# EAGLE board tester (EAGLE 7.5.0)
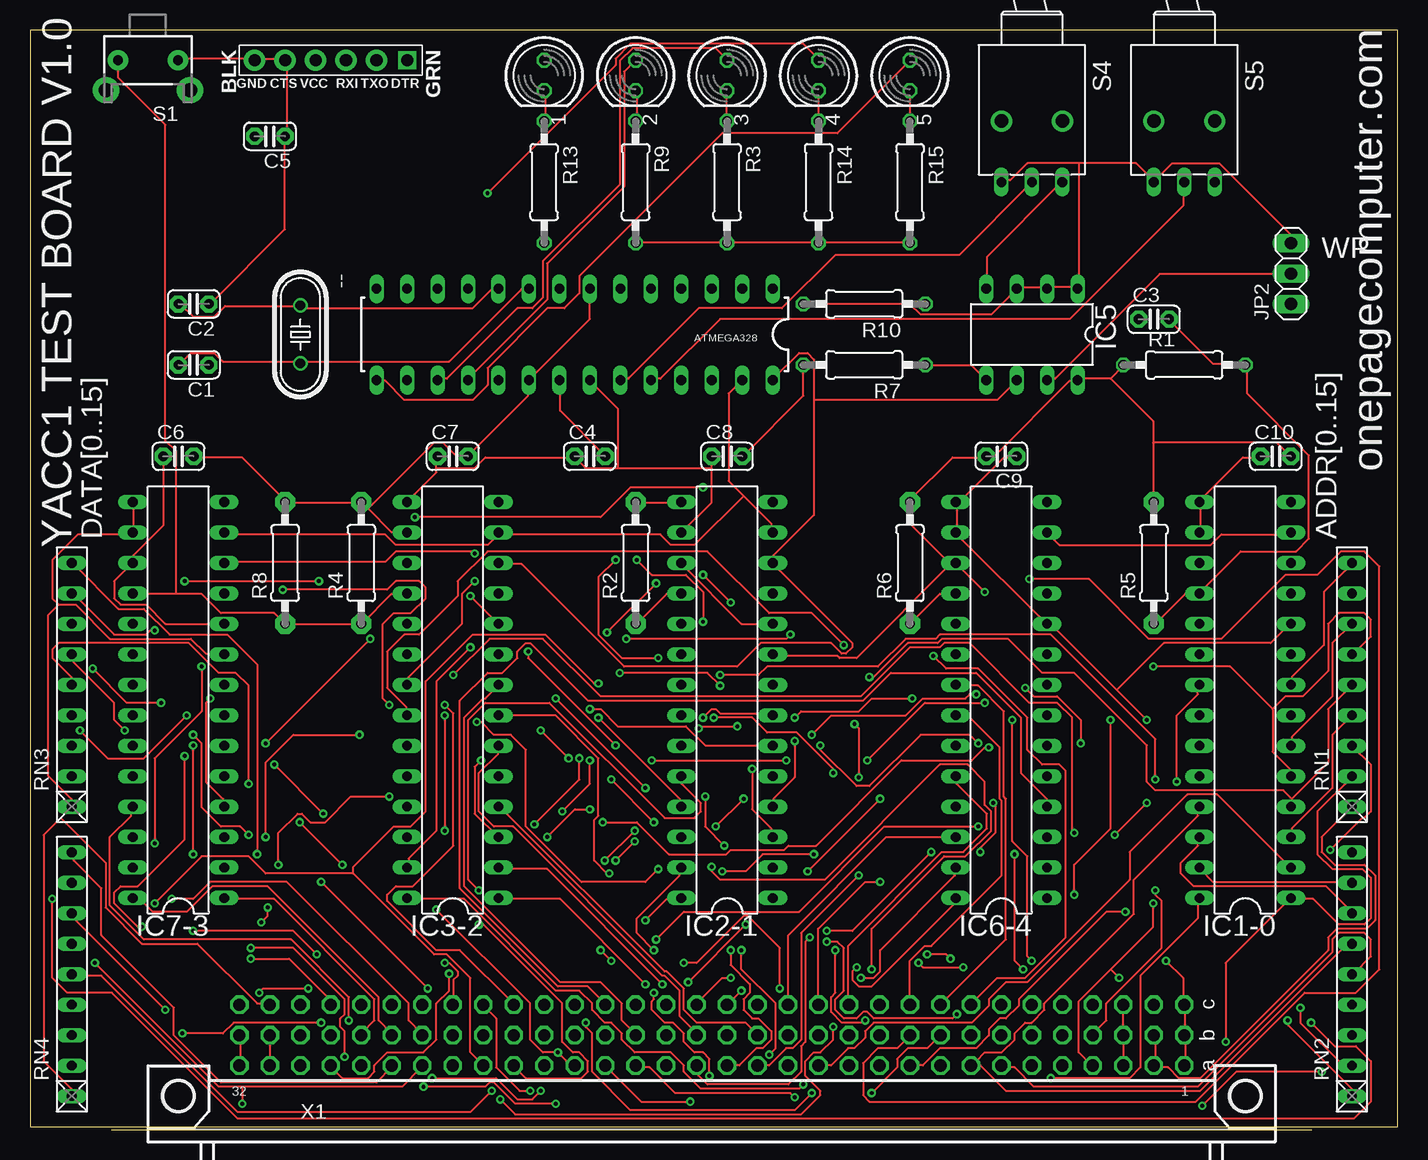
[diagram p3: board, top side]
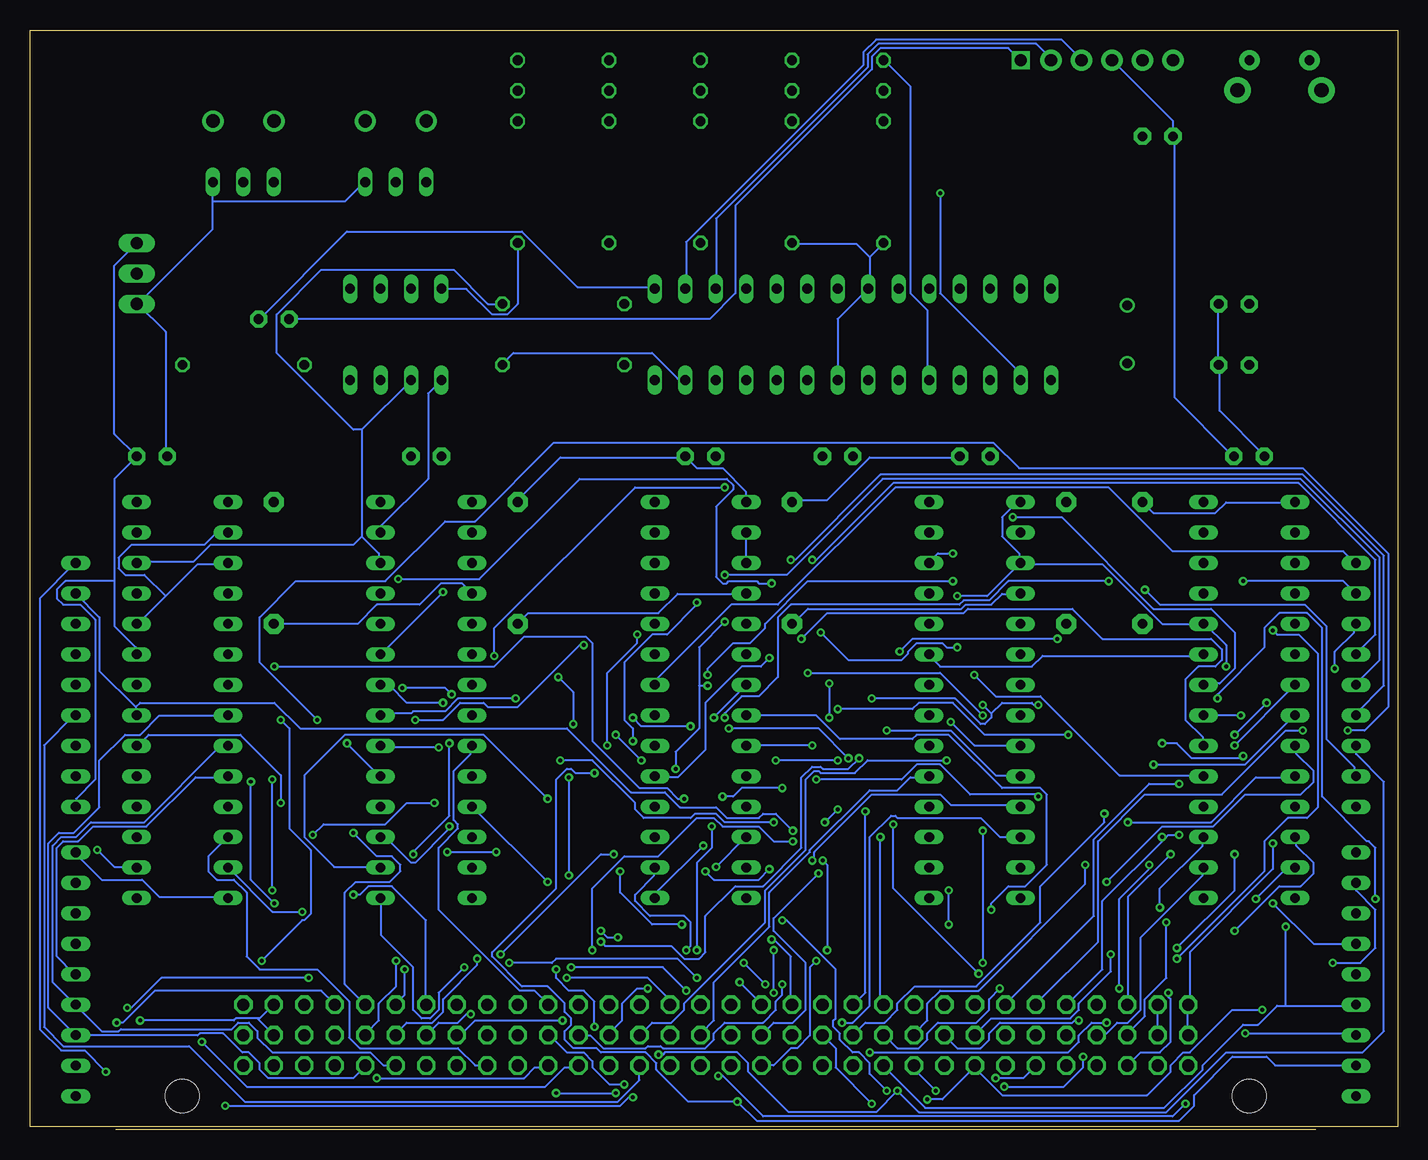
[diagram p4: board, bottom side, seen from below]

Size 113.97 x 91.42 mm. Coordinates in mm from the lower left corner, seen from the top.
Outline: 113.97,0 113.97,91.42 0,91.42 0,0 113.97,0
Copper layers (1*16): Top 0.0356mm / dielectric 1.5011mm / Bottom 0.0356mm
Design rules "LaenPCBOrder *": minimum track width 6mil, minimum drill 13mil, track to track 8mil, track to pad 8mil, pad to pad 8mil, via to via 8mil, smd to smd 6mil, copper to edge 15mil, drill to drill 6mil, minimum pad ring 7mil, minimum via ring 7mil, stop-mask expansion 3mil, vias tented up to drill 0mil, thermal gap 10mil

## Footprints (pad centres in the part's own frame; a part is rotated, then mirrored left to right if it is on the bottom)
LED5MM = drill 0.813 octagon: A -1.27,0; K 1.27,0
HC49/S = drill 0.813: 1 -2.413,0; 2 2.413,0
DIL28-3 = drill 0.813 long: 1 -16.51,-3.81; 2 -13.97,-3.81; 3 -11.43,-3.81; 4 -8.89,-3.81; 5 -6.35,-3.81; 6 -3.81,-3.81; 7 -1.27,-3.81; 8 1.27,-3.81; 9 3.81,-3.81; 10 6.35,-3.81; 11 8.89,-3.81; 12 11.43,-3.81; 13 13.97,-3.81; 14 16.51,-3.81; 15 16.51,3.81; 16 13.97,3.81; 17 11.43,3.81; 18 8.89,3.81; 19 6.35,3.81; 20 3.81,3.81; 21 1.27,3.81; 22 -1.27,3.81; 23 -3.81,3.81; 24 -6.35,3.81; 25 -8.89,3.81; 26 -11.43,3.81; 27 -13.97,3.81; 28 -16.51,3.81
C025-024X044 = drill 0.813 pad 1.422 octagon: 1 -1.27,0; 2 1.27,0
DIL8 = drill 0.813 long: 1 -3.81,-3.81; 2 -1.27,-3.81; 3 1.27,-3.81; 4 3.81,-3.81; 5 3.81,3.81; 6 1.27,3.81; 7 -1.27,3.81; 8 -3.81,3.81
FTDI_DEVICE_SIDE = drill 1 square: P$1 -6.35,0 | drill 1.016 pad 1.778: P$2 -3.81,0; P$3 -1.27,0; P$4 1.27,0; P$5 3.81,0; P$6 6.35,0
1X03 = drill 1.016 long: 1 -2.54,0; 2 0,0; 3 2.54,0
0207/10 = drill 0.813 octagon: 1 -5.08,0; 2 5.08,0
0207/10' = drill 0.813 pad 1.676 octagon: 1 -5.08,0; 2 5.08,0
RN-9 = drill 0.813 long: 1 -10.16,0; 2 -7.62,0; 3 -5.08,0; 4 -2.54,0; 5 0,0; 6 2.54,0; 7 5.08,0; 8 7.62,0; 9 10.16,0
TACTILE-PTH-SIDEEZ = drill 0.8 pad 1.7: 1 -2.5,0; 2 2.5,0 | drill 1.2 pad 2.2: ANCHOR1 -3.5,2.5; ANCHOR2 3.5,2.5
9070-1W = drill 0.813 long: 1 5.08,-2.54; 2 5.08,0; 3 5.08,2.54 | drill 1.118 pad 1.778: B 0,-2.54; B1 0,2.54
FABC96R = drill 1.016 octagon: A1 -2.54,39.37; A2 -2.54,36.83; A3 -2.54,34.29; A4 -2.54,31.75; A5 -2.54,29.21; A6 -2.54,26.67; A7 -2.54,24.13; A8 -2.54,21.59; A9 -2.54,19.05; A10 -2.54,16.51; A11 -2.54,13.97; A12 -2.54,11.43; A13 -2.54,8.89; A14 -2.54,6.35; A15 -2.54,3.81; A16 -2.54,1.27; A17 -2.54,-1.27; A18 -2.54,-3.81; A19 -2.54,-6.35; A20 -2.54,-8.89; A21 -2.54,-11.43; A22 -2.54,-13.97; A23 -2.54,-16.51; A24 -2.54,-19.05; A25 -2.54,-21.59; A26 -2.54,-24.13; A27 -2.54,-26.67; A28 -2.54,-29.21; A29 -2.54,-31.75; A30 -2.54,-34.29; A31 -2.54,-36.83; A32 -2.54,-39.37; B1 -5.08,39.37; B2 -5.08,36.83; B3 -5.08,34.29; B4 -5.08,31.75; B5 -5.08,29.21; B6 -5.08,26.67; B7 -5.08,24.13; B8 -5.08,21.59; B9 -5.08,19.05; B10 -5.08,16.51; B11 -5.08,13.97; B12 -5.08,11.43; B13 -5.08,8.89; B14 -5.08,6.35; B15 -5.08,3.81; B16 -5.08,1.27; B17 -5.08,-1.27; B18 -5.08,-3.81; B19 -5.08,-6.35; B20 -5.08,-8.89; B21 -5.08,-11.43; B22 -5.08,-13.97; B23 -5.08,-16.51; B24 -5.08,-19.05; B25 -5.08,-21.59; B26 -5.08,-24.13; B27 -5.08,-26.67; B28 -5.08,-29.21; B29 -5.08,-31.75; B30 -5.08,-34.29; B31 -5.08,-36.83; B32 -5.08,-39.37; C1 -7.62,39.37; C2 -7.62,36.83; C3 -7.62,34.29; C4 -7.62,31.75; C5 -7.62,29.21; C6 -7.62,26.67; C7 -7.62,24.13; C8 -7.62,21.59; C9 -7.62,19.05; C10 -7.62,16.51; C11 -7.62,13.97; C12 -7.62,11.43; C13 -7.62,8.89; C14 -7.62,6.35; C15 -7.62,3.81; C16 -7.62,1.27; C17 -7.62,-1.27; C18 -7.62,-3.81; C19 -7.62,-6.35; C20 -7.62,-8.89; C21 -7.62,-11.43; C22 -7.62,-13.97; C23 -7.62,-16.51; C24 -7.62,-19.05; C25 -7.62,-21.59; C26 -7.62,-24.13; C27 -7.62,-26.67; C28 -7.62,-29.21; C29 -7.62,-31.75; C30 -7.62,-34.29; C31 -7.62,-36.83; C32 -7.62,-39.37 | hole 2.794: 0,-44.456; 0,44.456

## Placement (x,y rotation side)
1  [LED5MM]  42.85,87.63 270 top
2  [LED5MM]  50.47,87.63 270 top
3  [LED5MM]  58.09,87.63 270 top
4  [LED5MM]  65.71,87.63 270 top
5  [LED5MM]  73.33,87.63 270 top
--  16Mhz  [HC49/S]  22.53,66.04 270 top
ATMEGA328  ATMEGA328P_PDIP  [DIL28-3]  45.39,66.04 180 top
C1  20pf  [C025-024X044]  13.64,63.5 180 top
C2  20pf  [C025-024X044]  13.64,68.58 180 top
C3  0.1  [C025-024X044]  93.65,67.31 0 top
C4  0.1  [C025-024X044]  46.66,55.88 0 top
C5  0.1  [C025-024X044]  19.99,82.55 180 top
C6  0.1  [C025-024X044]  12.37,55.88 0 top
C7  0.1  [C025-024X044]  35.23,55.88 0 top
C8  0.1  [C025-024X044]  58.09,55.88 0 top
C9  0.1  [C025-024X044]  80.95,55.88 180 top
C10  0.1  [C025-024X044]  103.81,55.88 0 top
IC1-0  MCP23017SP  [DIL28-3]  101.27,35.56 90 top
IC2-1  MCP23017SP  [DIL28-3]  58.09,35.56 90 top
IC3-2  MCP23017SP  [DIL28-3]  35.23,35.56 90 top
IC5  24AA01P  [DIL8]  83.49,66.04 180 top
IC6-4  MCP23017SP  [DIL28-3]  80.95,35.56 90 top
IC7-3  MCP23017SP  [DIL28-3]  12.37,35.56 90 top
JP1  FTDI_DEVICE  [FTDI_DEVICE_SIDE]  25.07,88.9 180 top
JP2  [1X03]  105.08,71.12 90 top
R1  10k  [0207/10]  96.19,63.5 0 top
R2  10k  [0207/10']  50.47,46.99 90 top
R3  330  [0207/10]  58.09,78.74 270 top
R4  10k  [0207/10']  27.61,46.99 90 top
R5  10k  [0207/10']  93.65,46.99 90 top
R6  10k  [0207/10']  73.33,46.99 90 top
R7  2.2k  [0207/10]  69.52,63.5 180 top
R8  10k  [0207/10']  21.26,46.99 90 top
R9  330  [0207/10]  50.47,78.74 270 top
R10  2.2k  [0207/10]  69.52,68.58 180 top
R13  330  [0207/10]  42.85,78.74 270 top
R14  330  [0207/10]  65.71,78.74 270 top
R15  330  [0207/10]  73.33,78.74 270 top
RN1  [RN-9]  110.16,36.83 90 top
RN2  [RN-9]  110.16,12.7 90 top
RN3  [RN-9]  3.48,36.83 90 top
RN4  [RN-9]  3.48,12.7 90 top
S1  SWITCH-MOMENTARY-2SIDE_EZ  [TACTILE-PTH-SIDEEZ]  9.83,88.9 180 top
S4  [9070-1W]  83.49,83.82 270 top
S5  [9070-1W]  96.19,83.82 270 top
X1  FABC96R  [FABC96R]  56.82,2.54 270 top

## Tracks (layer width: path | path; a pad name or v marks a point on that pad's centre or on a via)
+12V
  Top 0.152: X1.A3 X1.B3 X1.C3
-RESET
  Top 0.152: IC3-2.18 31.37,44.4 30.12,44.4 27.64,41.91 R4.1 R8.1 21.23,41.91 20.35,42.8 15.9,42.8 14.3,44.4 12.17,44.4 | 12.17,44.4 8.61,44.4 IC7-3.18 | 12.17,44.4 12.17,56.31 11.28,57.2 11.28,83.51 7.37,87.43 7.37,88.85 S1.2 | C3.2 95.02,67.16 98.58,63.6 101.24,63.6 R1.2 101.42,63.42 101.42,61.11 106.58,55.96 106.58,49.02 105.51,47.96 100.89,47.96 97.51,44.58 IC1-0.18 97.33,44.4 96.27,44.4 93.78,41.91 R5.1 | IC2-1.18 54.13,44.4 53.06,44.4 50.57,41.91 R2.1 | R6.1 75.82,44.4 77.06,44.4 IC6-4.18
  Bottom 0.152: ATMEGA328.1 61.95,70 68.35,70 72.97,74.62 87.55,74.62 94.84,67.34 C3.2 | R6.1 72.44,42.8 61.59,42.8 59.99,44.4 54.3,44.4 IC2-1.18 | R5.1 86.66,41.91 85.06,43.51 81.51,43.51 79.73,45.29 77.95,45.29 77.24,44.58 IC6-4.18 | IC3-2.18 31.55,44.4 32.97,44.4 33.86,43.51 35.99,43.51 36.35,43.15 49.15,43.15 50.39,41.91 R2.1
ADDR0  (via drill 0.33)
  Top 0.152: v95.55,28.75 95.55,34.26 97.33,36.04 97.33,36.75 IC1-0.21 | v93.6,18.62 93.6,16.66 90.04,13.11 | 90.04,13.11 87.38,10.44 87.38,6.17 88.44,5.1 X1.A4 | v105.87,9.91 105.87,8.66 109.42,5.1 110.13,5.1 RN2.2 | 90.04,13.11 v90.75,12.39
  Bottom 0.152: v95.55,28.75 95.55,20.57 v93.6,18.62 | v105.87,9.91 105.51,9.91 103.02,12.39 v90.75,12.39
ADDR1
  Bottom 0.152: X1.A5 86.13,4.93 87.02,4.04 94.13,4.04 94.84,4.75 94.84,5.28 95.73,6.17 96.27,6.17 97.87,7.77 99.82,7.77 100,7.59 110.13,7.59 RN2.3 112.45,9.91 112.45,23.6 111.56,24.49 110.31,24.49 108.18,26.62 108.18,30.53 106.04,32.66 104.8,32.66 103.2,34.26 97.51,34.26 IC1-0.22
ADDR2
  Bottom 0.152: IC1-0.23 97.51,31.6 98.22,31.6 104.44,25.38 108.89,25.38 110.13,24.13 111.38,24.13 112.09,23.42 112.09,12.04 110.31,10.26 RN2.4 110.13,10.08 108,7.95 106.58,7.95 106.4,8.13 97.15,8.13 96.62,8.66 95.73,8.66 95.02,7.95 95.02,7.42 93.78,6.17 85.6,6.17 84.53,5.1 83.64,5.1 X1.A6
ADDR3
  Top 0.152: X1.A7 80.97,4.93 82.04,4.93 83.64,3.33 97.33,3.33 108.53,14.53 108.53,15.6 109.07,16.13 111.2,16.13 111.73,15.6 111.73,14.17 110.31,12.75 RN2.5
  Bottom 0.152: IC1-0.24 97.51,29.11 100.18,29.11 104.27,25.02 108.71,25.02 109.96,23.77 111.2,23.77 111.73,23.24 111.73,14.17 110.31,12.75 RN2.5
ADDR4
  Top 0.152: 78.84,5.46 78.49,5.1 X1.A8 78.84,5.46 | 78.84,5.46 79.55,6.17 80.97,6.17 82.04,7.24 82.04,7.77 82.93,8.66 83.46,8.66 84.53,9.73 84.53,10.26 92,17.73 92,20.57 97.33,25.91 97.33,26.62 IC1-0.25 | RN2.6 109.78,15.24 97.51,2.97 81.33,2.97 78.84,5.46
ADDR5
  Top 0.152: IC1-0.26 97.33,24.13 97.33,23.42 95.91,22 95.91,21.11 96.98,20.04 108,20.04 110.13,17.91 RN2.7
  Bottom 0.152: X1.A9 76,5.1 76.89,5.1 78.31,6.53 86.49,6.53 87.38,7.42 87.38,10.44 90.04,13.11 94.84,13.11 95.91,14.17 95.91,19.51 96.98,20.57 98.4,20.57 99.11,21.28 99.11,22.53 97.51,24.13 IC1-0.26
ADDR6  (via drill 0.33)
  Top 0.152: RN2.8 110.13,20.4 98.58,20.4 97.51,21.46 IC1-0.27 | v91.29,17.91 89.69,17.91 82.4,10.62 82.4,10.08 81.33,9.02 80.8,9.02 79.91,8.13 79.91,7.59 78.84,6.53 75.82,6.53 74.4,5.1 73.33,5.1 X1.A10
  Bottom 0.152: v91.29,17.91 93.78,17.91 IC1-0.27
ADDR7  (via drill 0.33)
  Top 0.152: v85.06,4.04 91.64,4.04 92.53,4.93 92.53,12.57 97.33,17.37 97.33,18.97 IC1-0.28
  Bottom 0.152: IC1-0.28 97.51,19.15 103.2,19.15 104.62,20.57 108,20.57 110.13,22.71 RN2.9 | v85.06,4.04 72.8,4.04 71.91,4.93 70.84,4.93 X1.A11
ADDR8  (via drill 0.33)
  Top 0.152: RN1.2 110.13,29.11 107.29,26.26 107.29,22.71 108.53,21.46 111.02,21.46 111.73,20.75 111.73,17.37 111.2,16.84 109.07,16.84 106.93,18.97 105.16,18.97 IC1-0.1 104.98,18.97 99.64,13.64 v99.64,7.06
  Bottom 0.152: v99.64,7.06 95.91,3.33 71.02,3.33 69.42,4.93 68.35,4.93 X1.A12
ADDR9  (via drill 0.33)
  Top 0.152: v108.36,23.06 111.02,25.73 111.2,25.73 111.73,26.26 111.73,30.18 RN1.3 | X1.A13 65.86,5.1 66.75,5.1 68.17,6.53 68.71,6.53 69.6,7.42 69.6,7.95 70.31,8.66 78.49,8.66 79.91,10.08 79.91,10.62 81.33,12.04 83.11,12.04 91.64,20.57 91.64,22.88 96.44,27.69 98.93,27.69 104.98,21.64 IC1-0.2
  Bottom 0.152: v108.36,23.06 106.93,21.64 105.16,21.64 IC1-0.2
ADDR10
  Top 0.152: RN1.4 108.53,32.66 108.53,28.22 105.16,24.84 105.16,24.13 IC1-0.3
  Bottom 0.152: X1.A14 63.2,4.93 63.2,3.86 64.97,2.08 96.09,2.08 100.71,6.71 111.2,6.71 112.8,8.31 112.8,31.77 110.31,34.26 RN1.4
ADDR11  (via drill 0.33)
  Top 0.152: 105.16,27.33 105.16,26.8 IC1-0.4 | 105.16,27.33 108.18,30.35 108.18,34.8 110.13,36.75 RN1.5 | v69.06,20.93 64.26,16.13 64.26,7.24 63.55,6.53 63.02,6.53 61.59,5.1 60.71,5.1 X1.A15 | v69.06,29.11 69.06,33.2 v68.71,33.55 | v69.95,37.46 70.31,37.46 73.15,40.31 75.64,40.31 76,40.66 81.51,40.66 84.35,37.82 87.02,37.82 93.07,31.77 93.07,28.75 93.78,28.04 104.44,28.04 105.16,27.33
  Bottom 0.152: v69.06,29.11 v69.06,20.93 | v68.71,33.55 68.71,36.22 v69.95,37.46
ADDR12  (via drill 0.33)
  Top 0.152: 103.56,34.8 103.56,31.24 104.98,29.82 104.98,29.29 IC1-0.5 | 103.56,34.8 104.62,35.87 106.04,35.87 108.18,38 108.18,41.91 109.07,42.8 111.2,42.8 111.73,42.27 111.73,40.84 110.31,39.42 RN1.6 | v58.4,14.71 58.4,13.46 59.99,11.86 59.99,11.15 59.46,10.62 59.46,9.73 60.17,9.02 60.71,9.02 61.77,7.95 61.77,7.24 61.06,6.53 60.53,6.53 59.11,5.1 58.22,5.1 X1.A16 | v59.46,27.33 v57.15,25.02 | v93.6,38.35 100,38.35 103.56,34.8
  Bottom 0.152: v58.4,14.71 58.4,22 57.15,23.24 v57.15,25.02 | v59.46,27.33 59.99,27.33 60.88,28.22 63.2,28.22 67.11,32.13 67.11,40.31 67.64,40.84 72.8,40.84 75.29,38.35 v93.6,38.35
ADDR13  (via drill 0.33)
  Top 0.152: IC1-0.6 105.16,31.77 105.16,32.49 108.53,35.87 108.53,40.31 110.13,41.91 RN1.7 | X1.A17 55.55,4.39 56.44,3.5 63.2,3.5 64.26,4.57 64.26,6.71 64.62,7.06 64.62,15.42 v64.97,15.77 | v66.4,16.31 68.53,16.31 v75.11,22.88 | v79.2,22.88 79.2,23.24 80.44,24.49 80.44,26.8 v80.26,26.98 | v93.07,26.98 v90.4,24.31
  Bottom 0.152: v64.97,15.77 65.86,15.77 v66.4,16.31 | v79.2,22.88 v75.11,22.88 | v80.26,26.98 82.58,26.98 84.35,25.2 89.51,25.2 v90.4,24.31 | v93.07,26.98 93.07,29.29 96.44,32.66 104.09,32.66 104.98,31.77 IC1-0.6
ADDR14  (via drill 0.33)
  Top 0.152: v47.55,14.71 v48.44,13.82 | v50.39,24.66 v47.91,22.17
  Bottom 0.152: 105.16,34.98 105.16,34.44 IC1-0.7 | 105.16,34.98 108.18,38 108.18,42.44 110.13,44.4 RN1.8 | v48.44,13.82 48.97,13.28 48.97,7.59 50.04,6.53 50.57,6.53 51.99,5.1 52.88,5.1 X1.A18 | v47.55,14.71 47.55,21.82 v47.91,22.17 | v50.39,24.66 51.82,26.09 52.88,26.09 53.24,25.73 55.91,25.73 56.8,26.62 59.82,26.62 61.06,27.86 63.91,27.86 69.24,33.2 91.47,33.2 93.6,35.33 104.8,35.33 105.16,34.98
ADDR15  (via drill 0.33)
  Top 0.152: IC1-0.8 105.16,36.93 105.16,37.46 107.82,40.13 107.82,44.58 110.13,46.89 RN1.9 | v63.73,2.44 63.37,2.79 53.77,2.79 51.64,4.93 50.57,4.93 X1.A19 | v97.69,1.73 100.53,4.57 v107.64,4.57
  Bottom 0.152: v63.73,2.44 64.08,2.44 64.8,1.73 v97.69,1.73 | v107.64,4.57 109.42,6.35 111.38,6.35 113.16,8.13 113.16,44.04 110.31,46.89 RN1.9
ARD-RXIN
  Bottom 0.152: ATMEGA328.2 59.28,70 59.28,73.74 44.53,88.49 44.53,89.56 43.46,90.63 27.99,90.63 26.39,89.03 JP1.P$3
ARD-TXOUT
  Bottom 0.152: ATMEGA328.3 56.8,70 56.8,75.69 44.17,88.32 44.17,89.38 43.28,90.27 30.12,90.27 28.88,89.03 JP1.P$2
CNTL0  (via drill 0.33)
  Top 0.152: v37.06,45.47 35.99,44.4 35.99,41.91 31.55,37.46 31.55,36.93 IC3-2.21 | v57.51,37.64 60.71,37.64 61.42,38.35 70.66,38.35 72.97,40.66 75.46,40.66 75.82,41.02 85.06,41.02 93.78,32.31 v93.78,28.93 | v93.78,19.68 93.78,19.33 94.31,18.8 94.31,14.88 89.69,10.26 89.69,8.84 88.62,7.77 X1.B4
  Bottom 0.152: v37.06,45.47 49.15,45.47 52.7,41.91 52.7,41.55 53.95,40.31 55.37,40.31 57.51,38.18 v57.51,37.64 | v93.78,19.68 v93.78,28.93
CNTL1  (via drill 0.33)
  Top 0.152: v67.82,40.13 65.15,42.8 61.59,42.8 56.44,47.96 38.13,47.96 35.64,45.47 35.64,44.22 32.44,41.02 31.19,41.02 29.77,39.6 29.77,36.58 31.37,34.98 31.37,34.44 IC3-2.22 | v81.86,33.91 81.86,23.77 83.11,22.53 83.11,14.17 v83.46,13.82
  Bottom 0.152: v67.82,40.13 68.17,40.13 73.33,34.98 75.82,34.98 76.17,35.33 78.13,35.33 79.55,33.91 v81.86,33.91 | v83.46,13.82 83.46,11.68 84.89,10.26 84.89,8.84 85.95,7.77 X1.B5
CNTL2  (via drill 0.33)
  Top 0.152: v37.24,33.73 37.59,33.73 38.66,32.66 40.08,32.66 41.33,31.42 41.33,25.02 45.95,20.4 51.28,20.4 v52.35,21.46 | v57.68,21.28 59.64,21.28 61.06,22.71 v65.33,22.71 | v74.75,14.35 76.35,14.35 v76.71,13.99
  Bottom 0.152: v37.24,33.73 35.28,31.77 31.55,31.77 IC3-2.23 | v52.35,21.46 53.24,20.57 56.97,20.57 v57.68,21.28 | v65.33,22.71 66.4,22.71 v74.75,14.35 | v76.71,13.99 76.71,13.46 79.55,10.62 79.55,9.55 80.44,8.66 82.58,8.66 83.46,7.77 X1.B6
CNTL3  (via drill 0.33)
  Top 0.152: v44.88,30.71 v42.57,33.02 | v66.4,15.42 67.28,15.42 67.82,14.88 67.82,11.33 67.11,10.62 67.11,9.73 67.82,9.02 68.88,9.02 69.42,9.55 69.77,9.55 70.31,9.02 76.89,9.02 v77.24,9.37
  Bottom 0.152: v42.57,33.02 37.24,33.02 33.5,29.29 31.55,29.29 IC3-2.24 | v44.88,30.71 45.77,29.82 47.91,29.82 48.08,30 48.79,30 49.68,29.11 49.68,23.24 52.88,20.04 55.19,20.04 57.68,17.55 57.68,14.53 58.22,13.99 59.46,13.99 60.53,15.06 66.04,15.06 v66.4,15.42 | v77.24,9.37 77.6,9.37 78.31,8.66 79.91,8.66 X1.B7
CNTL4  (via drill 0.33)
  Top 0.152: v50.39,23.77 v48.79,22.17 | v67.11,14.71 67.11,11.15 66.75,10.8 66.75,9.55 67.64,8.66 69.42,8.66 v69.6,8.84
  Bottom 0.152: v48.79,22.17 48.62,22.35 48.62,22.88 43.81,27.69 38.13,27.69 37.24,26.8 31.55,26.8 IC3-2.25 | v50.39,23.77 51.99,23.77 53.24,25.02 56.26,25.02 56.97,25.73 58.4,25.73 61.59,22.53 64.44,22.53 67.11,19.86 v67.11,14.71 | v69.6,8.84 76.89,8.84 77.95,7.77 78.31,7.77 X1.B8
CNTL5  (via drill 0.33)
  Top 0.152: v46.3,8.66 46.3,8.31 46.84,7.77 46.84,4.57 50.04,1.37 63.73,1.37 v65.15,2.79 | v70.13,2.79 72.26,4.93 72.26,5.64 73.15,6.53 74.75,6.53 75.82,7.59 X1.B9
  Bottom 0.152: IC3-2.26 33.15,24.13 34.75,25.73 41.68,25.73 41.86,25.91 42.22,25.91 43.99,24.13 43.99,10.08 45.41,8.66 v46.3,8.66 | v70.13,2.79 v65.15,2.79
CNTL6  (via drill 0.33)
  Top 0.152: v36.7,39.95 33.86,37.11 33.86,24.66 31.55,22.35 31.55,21.64 IC3-2.27 | v52.17,45.29 v48.08,41.2 | v83.29,45.64 88.27,45.64 93.24,40.66 99.29,40.66 104.62,46 107.29,46 109.25,47.96 111.2,47.96 112.45,46.71 112.45,13.11 110.49,11.15 106.22,11.15 97.15,2.08 69.95,2.08 69.42,2.62 69.42,5.28 70.66,6.53 72.26,6.53 73.33,7.59 X1.B10
  Bottom 0.152: v36.7,39.95 37.59,39.95 37.95,40.31 40.08,40.31 40.79,39.6 40.79,39.42 41.33,38.89 45.77,38.89 v48.08,41.2 | v52.17,45.29 53.24,45.29 53.42,45.47 55.73,45.47 55.91,45.29 56.26,45.29 56.8,45.82 56.8,51.69 55.37,53.11 55.37,53.47 55.91,54 68.17,54 76.53,45.64 v83.29,45.64
CNTL7  (via drill 0.33)
  Top 0.152: v64.44,3.5 64.08,3.15 55.91,3.15 54.48,4.57 54.48,5.1 53.42,6.17 50.39,6.17 49.33,7.24 49.33,7.77 48.44,8.66 47.91,8.66 46.84,9.73 46.84,10.26 45.77,11.33 43.81,11.33 36.17,18.97 31.55,18.97 IC3-2.28
  Bottom 0.152: v64.44,3.5 65.69,3.5 67.11,4.93 67.11,5.46 67.82,6.17 69.24,6.17 70.66,7.59 X1.B11
CNTL8  (via drill 0.33)
  Top 0.152: v51.28,11.86 44.17,18.97 39.19,18.97 IC3-2.1
  Bottom 0.152: v51.28,11.86 51.28,10.97 51.82,10.44 51.82,9.73 52.88,8.66 56.08,8.66 56.97,7.77 56.97,7.24 57.68,6.53 61.24,6.53 61.42,6.71 62.48,6.71 62.66,6.53 66.22,6.53 67.28,7.59 68.17,7.59 X1.B12
CNTL9  (via drill 0.33)
  Top 0.152: v52.7,11.86 43.1,21.46 39.19,21.46 IC3-2.2 | v54.48,13.64 55.55,13.64 59.46,17.55 59.82,17.55 62.48,14.88 v62.48,11.51
  Bottom 0.152: v54.48,13.64 v52.7,11.86 | v62.48,11.51 63.37,11.51 64.62,10.26 64.62,8.84 65.69,7.77 X1.B13
CNTL10  (via drill 0.33)
  Top 0.152: v37.59,30.53 37.06,30 37.06,26.09 39.02,24.13 IC3-2.3
  Bottom 0.152: v37.59,30.53 44.17,30.53 45.24,29.46 48.08,29.46 48.26,29.64 48.62,29.64 49.33,28.93 49.33,23.06 52.7,19.68 52.7,17.02 59.46,10.26 59.46,9.73 60.53,8.66 62.13,8.66 X1.B14
CNTL11
  Top 0.152: IC3-2.4 39.19,26.62 52.88,12.93 53.06,12.93 54.48,11.51 54.48,9.73 55.55,8.66 59.64,8.66 60.53,7.77 X1.B15
CNTL12
  Bottom 0.152: IC3-2.5 39.19,29.11 40.62,29.11 41.68,28.04 43.99,28.04 48.97,23.06 48.97,22.88 52.35,19.51 52.35,16.66 56.97,12.04 56.97,8.84 58.04,7.77 X1.B16
CNTL13
  Top 0.152: IC3-2.6 39.02,31.6 39.02,31.06 37.41,29.46 37.41,26.26 38.66,25.02 40.26,25.02 52.7,12.57 52.88,12.57 54.13,11.33 54.13,9.2 55.55,7.77 X1.B17
CNTL14  (via drill 0.33)
  Top 0.152: v48.26,21.11 48.08,21.11 47.02,22.17 47.02,25.55 47.37,25.91 47.37,30.71 43.81,34.26 39.19,34.26 IC3-2.7
  Bottom 0.152: v48.26,21.11 51.99,17.37 51.99,16.31 49.33,13.64 49.33,9.73 50.39,8.66 51.99,8.66 52.88,7.77 X1.B18
CNTL15
  Top 0.152: IC3-2.8 39.02,36.75 37.95,35.69 37.77,35.69 36.17,34.09 36.17,20.04 44.17,12.04 47.55,12.04 49.33,10.26 49.33,8.84 50.39,7.77 X1.B19
CNTL16  (via drill 0.33)
  Top 0.152: v13.59,22.71 v13.59,31.77 | v18.39,14.88 21.95,14.88 26.21,10.62 26.21,9.37 25.86,9.02 25.86,8.31 26.21,7.95 v26.21,5.82 | v32.79,3.33 37.95,3.33 38.3,3.68 38.66,3.68 40.44,1.91 v43.81,1.91
  Bottom 0.152: v13.59,31.77 8.61,36.75 IC7-3.21 | v13.59,22.71 13.59,19.68 v18.39,14.88 | v26.21,5.82 26.21,4.93 27.81,3.33 v32.79,3.33 | v43.81,1.91 46.84,4.93 46.84,6.53 X1.B20
CNTL17  (via drill 0.33)
  Top 0.152: v24.44,26.09 v20.35,30.18
  Bottom 0.152: v20.35,30.18 12.7,30.18 8.61,34.26 IC7-3.22 | v24.44,26.09 24.44,25.38 29.77,20.04 29.77,17.02 35.1,11.68 40.26,11.68 41.68,10.26 41.68,9.73 42.75,8.66 44.35,8.66 X1.B21
CNTL18  (via drill 0.33)
  Top 0.152: v33.15,11.51 v24.26,20.4
  Bottom 0.152: v24.26,20.4 19.63,25.02 15.37,25.02 12.7,27.69 8.08,27.69 7.01,28.75 7.01,29.64 8.43,31.06 8.43,31.6 IC7-3.23 | v33.15,11.51 34.04,10.62 34.04,9.73 35.1,8.66 38.3,8.66 39.19,7.77 39.19,7.24 39.9,6.53 41.68,6.53 42.75,7.59 X1.B22
CNTL19  (via drill 0.33)
  Top 0.152: v26.04,21.82 v22.48,25.38
  Bottom 0.152: v22.48,25.38 15.55,25.38 11.81,29.11 8.61,29.11 IC7-3.24 | v26.04,21.82 26.04,20.22 34.93,11.33 38.13,11.33 39.19,10.26 39.19,8.84 40.26,7.77 X1.B23
CNTL20  (via drill 0.33)
  Top 0.152: v26.57,8.84 26.57,10.8 21.77,15.6 9.5,15.6 6.66,18.44 6.66,24.13 8.43,25.91 8.43,26.62 IC7-3.25
  Bottom 0.152: v26.57,8.84 26.92,8.84 27.1,8.66 33.15,8.66 34.04,7.77 34.04,7.24 34.75,6.53 36.7,6.53 37.77,7.59 X1.B24
CNTL21  (via drill 0.33)
  Top 0.152: v13.59,16.31 21.95,16.31 v23.9,14.35
  Bottom 0.152: v13.59,16.31 9.86,20.04 8.08,20.04 7.01,21.11 7.01,22 8.43,23.42 8.43,24.13 IC7-3.26 | v23.9,14.35 23.9,12.93 26.57,10.26 26.57,9.73 27.28,9.02 33.86,9.02 35.1,7.77 X1.B25
CNTL22  (via drill 0.33)
  Top 0.152: v11.81,18.97 13.59,18.97 15.01,20.4 21.41,20.4 31.55,10.26 31.55,8.84 32.61,7.77 X1.B26
  Bottom 0.152: v11.81,18.97 9.32,21.46 8.61,21.46 IC7-3.27
CNTL23
  Top 0.152: IC7-3.28 8.61,18.97 9.14,18.97 10.21,17.91 13.06,17.91 15.19,20.04 19.81,20.04 29.06,10.8 29.06,8.84 30.12,7.77 X1.B27
CNTL24
  Top 0.152: IC7-3.1 16.26,18.97 20.35,18.97 28.7,10.62 28.7,8.84 27.64,7.77 X1.B28
CNTL25
  Bottom 0.152: IC7-3.2 16.26,21.46 16.26,20.93 21.41,15.77 21.41,9.73 22.48,8.66 23.37,8.66 24.26,7.77 24.97,7.77 X1.B29
CNTL26  (via drill 0.33)
  Top 0.152: v19.81,18.26 19.81,17.55 v19.28,17.02
  Bottom 0.152: v19.81,18.26 19.81,19.86 16.26,23.42 16.26,24.13 IC7-3.3 | v19.28,17.02 19.28,12.39 21.06,10.62 21.06,9.2 22.48,7.77 X1.B30
CNTL27  (via drill 0.33)
  Top 0.152: v15.01,35.69 14.66,35.33 14.66,28.75 16.08,27.33 16.08,26.8 IC7-3.4 | v1.85,18.97 1.85,12.39 3.1,11.15 6.83,11.15 17.32,0.66 110.31,0.66 111.73,2.08 111.73,5.46 110.49,6.71 108.71,6.71 v106.76,8.66
  Bottom 0.152: v15.01,35.69 15.01,36.04 11.1,39.95 11.1,41.55 9.86,42.8 7.54,42.8 6.3,41.55 6.3,27.51 2.57,23.77 2.39,23.77 1.85,23.24 v1.85,18.97 | v106.76,8.66 106.22,8.66 103.56,11.33 89.69,11.33 88.62,10.26 X1.C4
CNTL28  (via drill 0.33)
  Top 0.152: v35.28,37.64 38.3,40.66 42.75,40.66 47.55,35.87 69.24,35.87 73.33,39.95 75.82,39.95 76.17,40.31 78.31,40.31 83.29,35.33 85.6,35.33 86.84,34.09 86.84,24.66 v87.02,24.49
  Bottom 0.152: v35.28,37.64 33.5,35.87 29.77,35.87 23.19,29.29 16.26,29.29 IC7-3.5 | v87.02,24.49 85.06,22.53 83.82,22.53 83.11,21.82 83.11,21.28 84,20.4 86.84,20.4 87.73,19.51 87.73,11.86 X1.C5
CNTL29  (via drill 0.33)
  Top 0.152: v49.68,40.66 63.02,40.66 v63.37,41.02 | v65.86,31.77 65.86,31.42 68.88,28.4 69.95,28.4 74.22,32.66 78.31,32.66 v79.02,31.95 | v82.04,22.71 82.04,13.82 v82.75,13.11
  Bottom 0.152: v49.68,40.66 47.55,42.8 36.17,42.8 35.81,43.15 27.1,43.15 24.61,40.66 15.55,40.66 14.66,39.78 14.66,38.89 15.19,38.35 16.61,38.35 17.68,37.29 17.68,33.91 16.26,32.49 16.26,31.77 IC7-3.6 | v63.37,41.02 63.37,40.31 65.86,37.82 v65.86,31.77 | v79.02,31.95 79.02,25.91 82.04,22.88 v82.04,22.71 | v82.75,13.11 82.75,10.97 83.46,10.26 X1.C6
CNTL30  (via drill 0.33)
  Top 0.152: v13.06,34.26 9.5,30.71 6.48,30.71 v4.17,33.02 | v90.04,33.91 90.04,24.84 87.02,21.82 v87.02,19.33
  Bottom 0.152: v13.06,34.26 16.08,34.26 IC7-3.7 | v4.17,33.02 2.74,33.02 0.79,34.98 0.79,47.78 7.9,54.89 31.55,54.89 33.68,57.02 70.31,57.02 76.89,50.44 79.38,50.44 84.35,45.47 91.82,45.47 94.84,42.44 94.84,38.71 v90.04,33.91 | v87.02,19.33 86.49,19.33 85.78,20.04 83.82,20.04 80.97,17.2 80.97,10.26 X1.C7
CNTL31  (via drill 0.33)
  Top 0.152: v32.08,50.8 47.55,50.8 50.04,53.29 v56.08,53.29 | v75.29,39.24 76.35,38.18 79.02,38.18 83.11,34.09 83.11,31.42 84.35,30.18 85.78,30.18 86.31,29.64 86.31,15.77 82.93,12.39 80.62,12.39 78.49,10.26 X1.C8
  Bottom 0.152: v32.08,50.8 27.99,50.8 20.35,43.15 15.55,43.15 13.59,41.2 13.59,38.18 14.83,36.93 16.08,36.93 IC7-3.8 | v56.08,53.29 63.55,53.29 75.29,41.55 v75.29,39.24
CNTL32
  Top 0.152: IC6-4.21 77.24,36.75 79.02,36.75 81.15,34.62 81.15,27.51 81.33,27.33 81.33,15.6 76,10.26 X1.C9
CNTL33
  Top 0.152: X1.C10 73.33,13.82 74.57,15.06 75.11,15.06 80.97,20.93 80.97,27.15 80.8,27.33 80.8,31.6 78.13,34.26 77.24,34.26 IC6-4.22
CNTL34
  Bottom 0.152: IC6-4.23 77.24,31.6 77.24,31.06 78.66,29.64 78.66,25.55 78.31,25.2 78.31,24.84 79.91,23.24 79.91,18.09 73.15,11.33 71.91,11.33 70.84,10.26 X1.C11
CNTL35
  Top 0.152: IC6-4.24 77.24,29.11 77.24,28.57 79.73,26.09 79.73,24.84 77.77,22.88 76,22.88 68.17,15.06 68.17,10.26 X1.C12
CNTL36  (via drill 0.33)
  Top 0.152: v70.84,20.4 69.6,20.4 65.69,16.48 65.69,10.26 X1.C13
  Bottom 0.152: v70.84,20.4 77.06,26.62 IC6-4.25
CNTL37
  Top 0.152: IC6-4.26 71.37,24.13 63.2,15.95 63.2,10.26 X1.C14
CNTL38  (via drill 0.33)
  Top 0.152: v69.24,12.39 70.31,12.39 70.84,12.93 70.84,14.71 77.06,20.93 77.06,21.46 IC6-4.27
  Bottom 0.152: v69.24,12.39 62.48,12.39 60.71,10.62 60.71,10.26 X1.C15
CNTL39  (via drill 0.33)
  Top 0.152: v68.88,13.28 68.53,12.93 68.53,12.22 69.06,11.68 70.13,11.68 77.06,18.62 77.06,18.97 IC6-4.28 | v59.28,11.33 58.22,10.26 X1.C16
  Bottom 0.152: v68.88,13.28 61.24,13.28 v59.28,11.33
CNTL40  (via drill 0.33)
  Top 0.152: v77.77,13.28 74.4,13.28 v74.04,13.64 | v58.4,12.39 57.68,12.39 55.55,10.26 X1.C17
  Bottom 0.152: v77.77,13.28 79.91,11.15 79.91,9.73 80.62,9.02 81.33,9.02 82.04,9.73 82.04,13.28 84.71,15.95 84.71,18.97 IC6-4.1 | v74.04,13.64 70.48,13.64 70.13,13.99 59.99,13.99 v58.4,12.39
CNTL41  (via drill 0.33)
  Top 0.152: v64.8,21.28 v70.84,27.33 | v54.84,12.04 v59.64,16.84
  Bottom 0.152: v70.84,27.33 76.17,32.66 87.73,32.66 91.11,29.29 91.11,24.13 88.62,21.64 84.89,21.64 IC6-4.2 | v64.8,21.28 64.8,19.51 62.13,16.84 v59.64,16.84 | v54.84,12.04 53.06,10.26 X1.C18
CNTL42  (via drill 0.33)
  Top 0.152: v79.02,25.02 71.2,25.02 64.08,17.91 54.48,17.91 v52.17,15.6
  Bottom 0.152: IC6-4.3 84.35,24.13 82.22,22 81.86,22 79.02,24.84 v79.02,25.02 | v52.17,15.6 51.99,15.6 50.57,14.17 50.57,10.26 X1.C19
CNTL43
  Top 0.152: IC6-4.4 84.71,26.8 84.71,27.33 82.58,29.46 82.58,34.09 78.84,37.82 71.73,37.82 69.42,35.51 46.48,35.51 41.68,40.31 41.33,40.31 40.62,39.6 40.62,39.07 39.37,37.82 38.13,37.82 35.81,35.51 35.81,19.86 43.99,11.68 46.48,11.68 47.91,10.26 X1.C20
CNTL44  (via drill 0.33)
  Top 0.152: v87.55,31.95 87.55,33.91 85.6,35.87 83.64,35.87 v82.93,36.58 | v78.84,36.04 78.31,36.04 77.95,35.69 74.4,35.69 72.97,34.26 66.75,34.26 v65.15,32.66 | v51.82,30.53 v63.02,30.53 | v46.66,30.53 46.66,28.57 v44.35,26.26
  Bottom 0.152: v87.55,31.95 84.89,29.29 IC6-4.5 | v82.93,36.58 79.38,36.58 v78.84,36.04 | v63.02,30.53 v65.15,32.66 | v46.66,30.53 v51.82,30.53 | v44.35,26.26 44.35,11.15 45.24,10.26 X1.C21
CNTL45  (via drill 0.33)
  Top 0.152: v79.91,31.6 79.55,31.6 78.49,30.53 72.62,30.53 65.51,23.42 63.2,23.42 62.84,23.06 58.4,23.06 58.04,22.71 53.24,22.71 50.57,25.38 v47.73,25.38 | v46.66,26.44 45.41,26.44 v43.1,24.13
  Bottom 0.152: v79.91,31.6 84.71,31.6 IC6-4.6 | v46.66,26.44 v47.73,25.38 | v43.1,24.13 43.1,10.44 42.93,10.26 X1.C22
CNTL46  (via drill 0.33)
  Top 0.152: v73.51,35.69 70.13,35.69 69.06,34.62 64.26,34.62 v63.73,34.09 | v58.93,33.38 55.91,33.38 v55.73,33.2 | v45.77,30.71 45.77,28.93 v42.04,25.2 | v34.93,12.75 34.93,11.33 33.86,10.26 33.86,7.24 32.79,6.17 29.77,6.17 28.7,5.1 28.7,4.57 28.17,4.04 26.04,4.04 25.15,4.93 X1.A29
  Bottom 0.152: v73.51,35.69 78.31,35.69 79.38,34.62 82.04,34.62 82.22,34.44 84.71,34.44 IC6-4.7 | v63.73,34.09 63.02,33.38 v58.93,33.38 | v55.73,33.2 48.26,33.2 v45.77,30.71 | v42.04,25.2 42.04,19.86 v34.93,12.75
CNTL47  (via drill 0.33)
  Top 0.152: v79.55,35.33 74.57,35.33 v69.77,30.53 | v48.44,28.93 v51.99,25.38 | v29.95,27.51 26.75,27.51 24.61,25.38 23.37,25.38 22.66,26.09 22.3,26.09 20.7,24.49 v20.7,21.82 | v23.19,11.51 19.46,11.51 v19.1,11.15
  Bottom 0.152: v79.55,35.33 82.58,35.33 84,36.75 84.71,36.75 IC6-4.8 | v69.77,30.53 67.11,30.53 63.55,26.98 63.55,26.44 62.84,25.73 58.93,25.73 58.57,26.09 56.8,26.09 56.08,25.38 v51.99,25.38 | v48.44,28.93 41.33,28.93 40.08,30.18 38.13,30.18 35.64,27.69 30.12,27.69 v29.95,27.51 | v20.7,21.82 20.7,21.46 23.19,18.97 v23.19,11.51 | v19.1,11.15 19.1,10.8 18.92,10.62 18.92,7.06 19.81,6.17 21.41,6.17 22.48,5.1 X1.A30
DATA0  (via drill 0.33)
  Top 0.152: v55.02,2.08 50.93,2.08 X1.A20 | v56.97,34.09 60.17,34.09 61.42,32.84 63.91,32.84 66.93,29.82 v66.93,29.46
  Bottom 0.152: RN4.2 3.63,5.1 10.21,5.1 10.92,5.82 13.77,5.82 16.97,2.62 16.97,1.73 18.21,0.48 53.42,0.48 v55.02,2.08 59.11,2.08 61.77,4.75 61.77,5.28 62.66,6.17 66.4,6.17 66.75,6.53 68.71,6.53 69.42,7.24 69.42,7.95 68.88,8.48 68.88,9.02 69.42,9.55 69.42,10.26 70.84,11.68 72.97,11.68 75.46,14.17 75.46,14.53 70.13,19.86 70.13,28.93 69.24,29.82 68.88,29.82 68.53,29.46 v66.93,29.46 | v56.97,34.09 54.3,36.75 IC2-1.21
DATA1  (via drill 0.33)
  Top 0.152: v12.7,7.77 16.08,7.77 16.97,8.66 v24.26,8.66 | X1.A21 45.24,4.93 v43.99,6.17 42.75,6.17 41.68,7.24 41.68,10.26 v33.86,18.09
  Bottom 0.152: v12.7,7.77 3.63,7.77 RN4.3 | v24.26,8.66 25.5,8.66 26.57,7.59 26.57,7.06 27.46,6.17 v43.99,6.17 | v33.86,18.09 33.86,18.62 32.44,20.04 31.01,20.04 29.24,21.82 29.24,27.69 29.77,28.22 32.97,28.22 37.41,32.66 40.08,32.66 40.44,32.31 46.48,32.31 48.44,34.26 54.13,34.26 IC2-1.22
DATA2  (via drill 0.33)
  Top 0.152: v48.79,31.77 41.5,39.07 v41.5,39.6 | v19.63,31.95 v28.35,40.66 | v12.88,30.89 12.88,23.95 8.97,20.04 7.54,20.04 7.01,19.51 7.01,18.62 8.97,16.66 v9.32,16.66
  Bottom 0.152: 9.32,10.08 10.03,10.08 11.63,8.48 12.88,8.48 16.26,5.1 16.26,4.75 19.46,1.55 39.37,1.55 42.75,4.93 X1.A22 | 9.32,10.08 3.63,10.08 RN4.4 | v48.79,31.77 54.13,31.77 IC2-1.23 | v41.5,39.6 40.44,40.66 v28.35,40.66 | v19.63,31.95 18.39,31.95 17.14,30.71 13.06,30.71 v12.88,30.89 | 9.32,10.08 v9.32,16.66
DATA3  (via drill 0.33)
  Top 0.152: v38.48,2.97 36.7,1.19 17.32,1.19 5.94,12.57 3.63,12.57 RN4.5 | v37.41,19.68 36.52,20.57 36.52,33.91 37.95,35.33 43.28,35.33 52.88,25.73 55.37,25.73 55.91,26.26 55.91,26.98 54.3,28.57 54.3,29.11 IC2-1.24 | v37.41,16.84 37.77,16.84 44.35,10.26 44.35,7.06 45.24,6.17 45.77,6.17 46.48,5.46 46.48,4.57 45.95,4.04 41.33,4.04 40.44,4.93 X1.A23
  Bottom 0.152: v38.48,2.97 40.44,4.93 X1.A23 | v37.41,16.84 v37.41,19.68
DATA4  (via drill 0.33)
  Top 0.152: v10.39,18.62 14.3,22.53 18.21,22.53 19.63,21.11 26.92,21.11 | 26.92,21.11 33.68,14.35 34.75,14.35 36.7,12.39 36.7,6.17 37.77,5.1 X1.A24 | v47.37,34.09 54.13,27.33 54.13,26.8 IC2-1.25 | v47.37,36.93 47.02,36.93 42.93,41.02 36.88,41.02 32.97,37.11 32.97,26.26 31.73,25.02 30.3,25.02 26.92,21.64 26.92,21.11
  Bottom 0.152: RN4.6 7.01,15.24 v10.39,18.62 | v47.37,36.93 v47.37,34.09
DATA5  (via drill 0.33)
  Top 0.152: v11.28,9.73 3.63,17.37 3.63,17.73 RN4.7 | v56.8,21.64 56.8,21.28 57.51,20.57 66.22,20.57 75.82,30.18 78.13,30.18 79.55,28.75 79.55,26.8 80.09,26.26 80.09,24.66 77.95,22.53 76.17,22.53 70.13,16.48 v70.13,13.11 | v66.93,8.31 66.93,7.24 65.86,6.17 65.33,6.17 64.62,5.46 64.62,4.22 65.86,2.97 65.86,2.62 64.26,1.02 40.44,1.02 v39.19,2.26
  Bottom 0.152: v11.28,9.73 13.77,9.73 17.32,6.17 17.86,6.17 18.92,5.1 18.92,4.57 20.88,2.62 32.97,2.62 35.28,4.93 | v56.8,21.64 54.3,24.13 IC2-1.26 | v70.13,13.11 70.13,12.39 69.06,11.33 67.82,11.33 66.93,10.44 v66.93,8.31 | v39.19,2.26 37.95,2.26 35.28,4.93 | 35.28,4.93 X1.A25
DATA6  (via drill 0.33)
  Top 0.152: v5.41,13.64 15.72,3.33 17.68,3.33 | 17.68,3.33 31.01,3.33 32.61,4.93 X1.A26 | v51.99,14.71 50.57,16.13 50.57,17.37 54.13,20.93 54.13,21.46 IC2-1.27 | v51.99,11.15 51.99,10.62 51.82,10.44 51.82,9.73 52.88,8.66 53.59,8.66 54.48,7.77 54.48,7.06 55.37,6.17 56.08,6.17 56.62,5.64 v56.62,4.22 | 17.68,3.33 v17.68,1.91
  Bottom 0.152: v5.41,13.64 3.1,13.64 1.85,14.88 1.85,18.09 3.46,19.68 3.46,20.22 RN4.8 | v51.99,11.15 v51.99,14.71 | v56.62,4.22 56.26,4.22 52.88,0.84 18.75,0.84 v17.68,1.91
DATA7  (via drill 0.33)
  Top 0.152: RN4.9 3.63,22.71 3.63,22.17 5.94,19.86 5.94,15.95 11.99,9.91 11.99,7.59 15.9,3.68 28.88,3.68 30.12,4.93 X1.A27 | v51.28,17.2 53.06,18.97 54.13,18.97 IC2-1.28 | v42.57,2.97 41.86,2.26 40.62,2.26 38.84,4.04 v33.5,4.04
  Bottom 0.152: v51.28,17.2 50.93,17.2 46.84,13.11 46.84,9.02 47.02,8.84 47.02,8.31 46.48,7.77 46.48,7.24 45.41,6.17 44.88,6.17 43.99,5.28 43.99,4.39 v42.57,2.97 | v33.5,4.04 31.19,4.04 X1.A27
DATA8  (via drill 0.33)
  Top 0.152: v57.86,23.42 56.26,25.02 v56.26,27.51 | v43.81,35.69 v51.28,28.22 | v34.57,35.15 35.28,34.44 35.28,23.42 31.9,20.04 30.48,20.04 29.77,19.33 29.77,18.8 33.86,14.71 35.81,14.71 40.26,10.26 X1.C23 | v21.06,44.76 29.77,44.76 30.48,45.47 32.44,45.47 32.97,44.93 32.97,44.04 31.73,42.8 30.3,42.8 29.41,41.91 29.41,35.69 v29.95,35.15
  Bottom 0.152: v57.86,23.42 61.77,19.51 61.77,19.15 IC2-1.1 | v56.26,27.51 55.37,27.51 54.66,28.22 v51.28,28.22 | v43.81,35.69 36.88,35.69 34.75,33.55 34.39,33.55 33.86,34.09 33.86,34.44 | v34.57,35.15 33.86,34.44 | v21.06,44.76 19.81,43.51 7.72,43.51 5.94,41.73 5.94,32.31 3.63,30 3.63,29.29 RN3.2 | v29.95,35.15 30.3,35.15 30.48,35.33 32.97,35.33 33.86,34.44
DATA9  (via drill 0.33)
  Top 0.152: v41.68,2.97 40.79,2.97 38.84,4.93 38.84,9.02 37.77,10.08 X1.C24 | v59.28,14.71 59.28,13.11 62.13,10.26 62.13,6.53 v61.59,5.99
  Bottom 0.152: RN3.3 3.46,31.6 3.46,31.06 1.14,28.75 1.14,7.95 2.92,6.17 14.3,6.17 19.28,1.19 39.9,1.19 v41.68,2.97 43.46,1.19 50.75,1.19 54.13,4.57 54.13,5.28 55.02,6.17 61.06,6.17 61.24,5.99 v61.59,5.99 | v59.28,14.71 58.93,15.06 58.93,17.02 59.46,17.55 62.31,17.55 63.55,18.8 63.55,19.33 61.95,20.93 61.95,21.46 IC2-1.2
DATA10  (via drill 0.33)
  Top 0.152: v60.17,29.82 60.17,26.44 61.77,24.84 61.77,24.13 IC2-1.3 | v56.08,42.09 56.08,44.58 54.66,46 51.82,46 v50.57,47.24 | v34.57,13.64 34.93,13.64 35.64,12.93 35.64,12.57 35.28,12.22 35.28,10.26 X1.C25 | v34.57,34.26 v34.57,24.66 | v49.15,37.82 56.44,37.82 v57.51,36.75
  Bottom 0.152: v60.17,29.82 60.17,31.24 58.22,33.2 58.22,36.75 | 58.22,36.75 58.22,39.95 v56.08,42.09 | v50.57,47.24 50.22,47.24 43.1,54.36 7.9,54.36 1.14,47.6 1.14,36.75 3.46,34.44 RN3.4 | v34.57,24.66 v34.57,13.64 | v34.57,34.26 38.13,37.82 v49.15,37.82 | 58.22,36.75 v57.51,36.75
DATA11  (via drill 0.33)
  Top 0.152: v18.21,28.57 18.21,36.75 17.14,37.82 15.72,37.82 13.23,40.31 2.39,40.31 1.85,39.78 1.85,39.07 3.46,37.46 3.46,36.93 RN3.5 | v63.73,32.13 63.73,29.11 61.95,27.33 61.95,26.8 IC2-1.4 | v56.08,46 v58.4,43.69
  Bottom 0.152: v18.21,28.57 20.7,28.57 25.32,23.95 25.32,17.55 32.61,10.26 X1.C26 | v63.73,32.13 63.73,33.2 64.44,33.91 64.44,38.71 62.13,41.02 60.88,41.02 58.4,43.51 v58.4,43.69 | v56.08,46 50.93,46 42.93,54 8.08,54 1.5,47.42 1.5,38.89 3.46,36.93 RN3.5
DATA12  (via drill 0.33)
  Top 0.152: v7.9,33.02 7.01,33.91 7.01,35.33 3.63,38.71 3.63,39.24 RN3.6 | v52.35,39.07 49.33,39.07 47.37,41.02 47.37,45.82 v48.79,47.24
  Bottom 0.152: v7.9,33.02 9.32,33.02 14.66,27.69 21.06,27.69 24.97,23.77 24.97,15.42 30.12,10.26 X1.C27 | v52.35,39.07 53.06,38.35 54.66,38.35 57.68,35.33 57.68,31.42 59.99,29.11 61.77,29.11 IC2-1.5 | v48.79,47.24 48.44,47.24 42.04,53.65 8.25,53.65 1.85,47.24 1.85,41.02 3.46,39.42 RN3.6
DATA13  (via drill 0.33)
  Top 0.152: v5.23,38.18 8.08,35.33 v10.92,35.33 | v13.59,32.66 14.3,31.95 14.3,26.62 15.9,25.02 17.5,25.02 v18.21,24.31 | v46.66,34.8 47.55,34.8 48.97,33.38 54.66,33.38 56.26,31.77 61.77,31.77 IC2-1.6 | v27.46,32.66 21.95,32.66 19.63,30.35 v19.63,24.13
  Bottom 0.152: v5.23,38.18 5.23,39.6 3.63,41.2 3.63,41.91 RN3.7 | v13.59,32.66 v10.92,35.33 | v18.21,24.31 19.1,24.31 19.46,23.95 | 19.46,23.95 24.61,18.8 24.61,13.11 27.46,10.26 X1.C28 | v46.66,34.8 40.44,34.8 39.9,35.33 37.06,35.33 34.39,32.66 v27.46,32.66 | 19.46,23.95 v19.63,24.13
DATA14  (via drill 0.33)
  Top 0.152: v56.08,34.09 56.8,34.8 57.15,34.8 57.51,34.44 61.77,34.44 IC2-1.7 | v12.88,45.47 v24.08,45.47 | v18.39,13.99 21.59,13.99 24.97,10.62 24.97,10.26 X1.C29 | v10.39,41.38 10.03,41.38 9.68,41.02 7.01,41.02 3.63,44.4 RN3.8
  Bottom 0.152: v56.08,34.09 56.08,34.44 54.66,35.87 53.24,35.87 51.64,37.46 51.64,42.44 50.57,43.51 36.52,43.51 36.17,43.87 34.04,43.87 32.44,45.47 v24.08,45.47 | v12.88,45.47 4.52,45.47 3.63,44.58 RN3.8 | v18.39,13.99 11.1,21.28 11.1,23.77 9.14,25.73 7.54,25.73 6.66,26.62 6.66,39.42 8.25,41.02 10.03,41.02 v10.39,41.38
DATA15  (via drill 0.33)
  Top 0.152: v18.92,22.71 18.92,38.53 16.43,41.02 11.63,41.02 9.5,43.15 7.37,43.15 3.63,46.89 RN3.9
  Bottom 0.152: IC2-1.8 61.77,36.93 61.77,37.29 55.55,43.51 51.64,43.51 41.86,53.29 24.08,53.29 18.75,47.96 4.52,47.96 3.63,47.07 RN3.9 | v18.92,22.71 22.48,19.15 22.48,10.26 X1.C30
GND  (via drill 0.33)
  Top 0.152: S1.1 12.34,89.03 18.57,89.03 JP1.P$6 18.75,89.03 21.23,89.03 JP1.P$5 21.41,88.85 21.41,82.63 C5.1 21.23,82.45 21.23,74.8 15.01,68.58 C2.1 | X1.A32 17.5,5.1 17.5,7.59 X1.B32 | C6.1 11.1,50.09 8.61,47.6 8.61,47.07 IC7-3.17 8.43,46.89 7.01,45.47 7.01,44.04 7.54,43.51 9.68,43.51 11.28,41.91 IC7-3.10 | v10.39,23.6 10.39,30.71 14.3,34.62 v14.3,38.35 | X1.A1 96.27,5.1 96.27,7.59 X1.B1 96.27,7.77 96.27,10.08 X1.C1 96.09,10.26 96.09,12.39 v94.67,13.82 | 77.24,51.87 77.24,52.04 IC6-4.15 77.24,51.87 | 77.24,51.87 77.24,49.55 IC6-4.16 77.24,49.38 84.71,41.91 IC6-4.10 85.06,41.91 90.58,36.4 | 77.24,51.87 81.15,55.78 82.22,55.78 C9.1 | 90.58,36.4 v93.07,33.91 | IC1-0.16 97.51,49.55 97.51,52.04 IC1-0.15 97.51,52.22 101.07,55.78 102.49,55.78 C10.1 | IC2-1.10 59.28,41.91 54.3,46.89 IC2-1.17 | 56.8,54.89 56.8,52.04 IC2-1.16 | 56.8,54.89 56.8,55.78 C8.1 | v36.7,44.22 39.02,41.91 IC3-2.10 | 33.86,54.89 33.86,54.53 31.55,52.22 IC3-2.15 | 33.86,54.89 33.86,55.78 C7.1 | 33.86,54.89 37.06,54.89 37.95,55.78 45.24,55.78 C4.1 45.41,55.78 46.3,54.89 48.97,54.89 | 48.97,54.89 56.8,54.89 | IC5.4 79.73,70 79.73,72.49 85.95,78.72 S4.3 | R9.2 50.57,73.74 58.04,73.74 R3.2 58.22,73.74 65.69,73.74 R14.2 65.86,73.74 73.33,73.74 R15.2 | 48.97,54.89 48.97,59.87 46.66,62.18 ATMEGA328.22 | 90.58,36.4 94.49,40.31 103.38,40.31 104.98,41.91 IC1-0.10
  Bottom 0.152: X1.B32 17.5,7.77 17.5,10.08 X1.C32 17.32,10.26 17.32,14.53 10.39,21.46 v10.39,23.6 | C2.1 15.01,68.58 15.01,63.6 C1.1 14.83,63.42 14.83,59.69 11.1,55.96 C6.1 | v14.3,38.35 14.3,40.13 16.08,41.91 IC7-3.10 19.63,41.91 24.61,46.89 31.37,46.89 IC3-2.17 | v94.67,13.82 91.29,17.2 91.11,17.2 90.58,17.73 90.58,23.06 92.35,24.84 92.35,33.2 v93.07,33.91 | 102.67,44.22 104.98,41.91 IC1-0.10 | 102.67,44.22 100,46.89 97.51,46.89 IC1-0.17 | 98.75,77.11 98.75,74.8 104.98,68.58 | 98.75,77.11 98.75,78.72 S5.3 | 104.98,68.58 102.67,66.27 102.67,55.96 C10.1 | 104.98,68.58 JP2.1 | 102.67,44.22 104.44,46 106.04,46 106.58,46.53 106.58,47.42 105.51,48.49 99.47,48.49 98.58,49.38 97.51,49.38 IC1-0.16 | IC2-1.17 54.3,47.07 54.3,49.38 IC2-1.16 | IC3-2.17 31.55,47.07 31.55,47.78 32.97,49.2 32.97,50.8 31.55,52.22 IC3-2.15 | v36.7,44.22 34.21,44.22 31.55,46.89 IC3-2.17 | 43.99,72.49 43.99,70 ATMEGA328.8 44.17,69.82 46.66,67.34 ATMEGA328.22 | 43.99,72.49 42.93,73.56 R13.2 | 43.99,72.49 45.06,73.56 50.39,73.56 R9.2 | R15.2 73.33,68.58 74.22,67.69 75.46,67.69 77.6,69.82 79.55,69.82 IC5.4 | 98.75,77.11 87.73,77.11 86.13,78.72 S4.3
N$1
  Bottom 0.152: ATMEGA328.19 39.19,62.36 39.19,68.05 40.62,69.47 40.62,86.72 42.75,88.85 1.A
N$2
  Top 0.152: IC5.7 84.89,62.36 85.42,62.36 94.13,71.07 104.98,71.07 JP2.2
N$3
  Top 0.152: C1.2 12.52,63.6 13.41,64.49 15.37,64.49 16.08,63.78 22.48,63.78 --.2 22.66,63.78 34.93,63.78 40.97,69.82 41.5,69.82 ATMEGA328.9
N$4
  Top 0.152: C2.2 12.52,68.58 13.59,67.51 15.37,67.51 16.26,68.4 22.48,68.4 --.1 22.66,68.4 22.84,68.22 36.88,68.22 38.48,69.82 39.02,69.82 ATMEGA328.10
N$6
  Top 0.152: ATMEGA328.18 36.52,62.36 43.1,68.94 43.1,71.96 49.51,78.36 49.51,87.96 50.39,88.85 2.A
N$7
  Top 0.152: ATMEGA328.17 34.04,62.36 34.75,62.36 40.62,68.22 41.86,68.22 42.75,69.11 42.75,72.14 49.15,78.54 49.15,88.85 50.22,89.92 57.15,89.92 58.04,89.03 3.A
N$8  (via drill 0.33)
  Top 0.152: v38.13,77.83 48.79,88.49 48.79,89.03 50.04,90.27 64.44,90.27 65.69,89.03 4.A
  Bottom 0.152: v38.13,77.83 38.13,69.47 31.55,62.89 31.55,62.36 ATMEGA328.16
N$9
  Bottom 0.152: JP1.P$1 32.44,89.92 43.1,89.92 43.81,89.21 43.81,88.14 55.19,76.76 55.19,69.47 57.33,67.34 92.35,67.34 C3.1
N$10
  Top 0.152: ATMEGA328.15 28.88,62.18 29.59,62.18 31.19,60.58 36.88,60.58 38.13,61.82 38.13,63.25 43.1,68.22 44.53,68.22 45.77,69.47 45.77,70.89 57.68,82.8 67.28,82.8 73.33,88.85 5.A
N$11
  Top 0.152: R9.1 50.57,83.87 50.57,86.36 2.K
N$12
  Top 0.152: R13.1 42.93,83.87 42.93,86.36 1.K
N$13
  Top 0.152: R3.1 58.04,83.87 58.04,86.36 3.K
N$14
  Top 0.152: ATMEGA328.21 44.17,62.18 44.17,59.69 47.91,55.96 C4.2
N$15
  Top 0.152: R14.1 65.69,83.87 65.69,86.36 4.K
N$16
  Top 0.152: 5.K R15.1
N$18
  Top 0.152: S4.2 77.42,72.67 67.11,72.67 62.66,68.22 55.73,68.22 49.86,62.36 49.33,62.36 ATMEGA328.23
N$19
  Top 0.152: ATMEGA328.24 51.82,62.36 52.53,62.36 57.51,67.34 86.66,67.34 96.09,76.76 96.09,78.72 S5.2
SCL  (via drill 0.33)
  Top 0.152: v37.06,47.78 36.88,47.96 30.48,47.96 29.59,47.07 16.26,47.07 IC7-3.12 | 65.33,60.58 65.33,63.96 64.8,64.49 64.08,64.49 61.95,62.36 ATMEGA328.28 | 65.33,60.58 65.33,50.98 61.95,47.6 61.95,47.07 IC2-1.12 61.95,46.89 68.53,40.31 68.53,39.95 68,39.42 67.64,39.42 66.75,40.31 60.88,40.31 58.93,38.35 49.51,38.35 40.97,46.89 39.19,46.89 IC3-2.12 | 65.33,60.58 80.62,60.58 82.22,62.18 IC5.6
  Bottom 0.152: v37.06,47.78 38.3,47.78 39.02,47.07 IC3-2.12 | 86.31,49.2 84.89,47.78 84.89,47.07 IC6-4.12 | 86.31,58.09 86.31,49.2 | 86.31,58.09 82.22,62.18 IC5.6 | 86.31,49.2 87.02,48.49 98.93,48.49 100.36,47.07 104.98,47.07 IC1-0.12 | R10.1 75.82,68.58 78.66,71.43 89.69,71.43 93.42,67.69 93.42,64.49 87.02,58.09 86.31,58.09
SDA
  Top 0.152: IC7-3.13 16.26,49.38 29.59,49.38 30.48,48.49 38.13,48.49 39.02,49.38 IC3-2.13 39.19,49.38 52.53,49.38 53.42,48.49 55.37,48.49 59.46,52.58 | 59.46,52.58 58.22,53.82 58.22,61.11 59.28,62.18 ATMEGA328.27 | 59.46,52.58 61.77,50.27 61.77,49.55 IC2-1.13 | IC1-0.13 104.98,49.38 99.29,49.38 98.4,48.49 85.78,48.49 84.89,49.38 IC6-4.13 | IC5.5 78.49,63.42 74.75,63.42 R7.1
  Bottom 0.152: IC5.5 80.8,61.11 80.8,54 84.71,50.09 84.71,49.55 IC6-4.13 | ATMEGA328.27 59.46,62.36 59.99,62.36 62.13,64.49 73.69,64.49 74.57,63.6 R7.1
VCC  (via drill 0.33)
  Top 0.152: X1.B31 X1.A31 | 2.57,25.73 3.46,26.62 RN3.1 3.46,26.8 3.46,27.33 1.5,29.29 1.5,42.62 2.39,43.51 | 2.57,25.73 1.14,24.31 1.14,5.46 3.46,3.15 3.46,2.62 RN4.1 | 2.57,25.73 6.3,22 6.3,18.26 9.32,15.24 13.95,15.24 18.92,10.26 19.99,10.26 X1.C31 | ATMEGA328.7 46.66,67.34 41.68,62.36 ATMEGA328.20 41.5,62.18 41.5,60.93 36.52,55.96 C7.2 36.35,55.96 35.46,55.96 34.39,57.02 33.68,57.02 28.17,51.51 | R4.2 28.17,51.51 | 28.17,51.51 30.12,49.55 31.37,49.55 IC3-2.16 | IC7-3.15 8.61,52.04 8.61,49.55 IC7-3.16 8.43,49.38 3.99,49.38 1.85,47.24 1.85,44.04 2.39,43.51 | C6.2 13.77,55.78 17.68,55.78 21.23,52.22 R8.2 21.41,52.04 27.46,52.04 R4.2 | 2.39,43.51 3.81,43.51 6.66,40.66 13.41,40.66 14.66,39.42 16.08,39.42 IC7-3.9 | 27.64,52.04 R4.2 | IC2-1.15 54.13,52.04 50.57,52.04 R2.2 | R7.2 64.44,60.93 59.46,55.96 C8.2 | 90.04,62.36 87.38,62.36 IC5.8 87.2,62.18 86.66,62.18 80.44,55.96 79.73,55.96 C9.2 79.55,55.78 76.89,55.78 73.33,52.22 R6.2 73.33,50.27 76.71,46.89 | 90.04,62.36 91.11,63.42 R1.1 | 93.6,57.02 93.6,58.8 90.04,62.36 | 93.6,57.02 93.6,52.22 R5.2 | 76.71,46.89 68.88,39.07 67.46,39.07 67.28,39.24 61.95,39.24 IC2-1.9 | 76.71,46.89 77.06,46.89 IC6-4.17 | IC6-4.17 v79.55,44.58 | 76.71,46.89 IC6-4.17 | R10.2 73.33,68.58 74.22,67.69 80.09,67.69 82.22,69.82 IC5.3 82.22,70 84.71,70 IC5.2 84.89,70 87.2,70 IC5.1 87.38,70 87.38,80.31 | 87.38,80.31 92.18,80.31 93.6,78.89 S5.1 93.78,78.89 95.2,80.31 99.11,80.31 104.98,74.45 104.98,73.74 JP2.3 | 87.38,80.31 83.11,80.31 81.69,78.89 80.97,78.89 S4.1 | X1.B2 93.78,7.59 93.78,5.1 X1.A2 93.78,4.93 94.84,4.93 95.73,4.04 97.51,4.04 108.18,14.71 108.18,15.77 108.89,16.48 111.38,16.48 112.09,17.2 112.09,20.93 111.2,21.82 108.71,21.82 107.64,22.88 107.64,24.13 110.13,26.62 RN1.1
  Top 0.152: v104.8,8.84 104.8,8.48 110.13,3.15 110.13,2.62 RN2.1 | 93.6,57.02 103.91,57.02 104.98,55.96 C10.2
  Bottom 0.152: X1.B31 X1.C31 | IC7-3.9 16.26,39.24 29.59,39.24 30.48,38.35 38.13,38.35 39.02,39.24 IC3-2.9 | JP1.P$4 23.72,88.85 18.75,83.87 18.75,82.63 C5.2 18.57,82.45 18.57,60.76 13.77,55.96 C6.2 | R8.2 20.35,51.16 15.19,51.16 14.3,52.04 8.61,52.04 IC7-3.15 | IC2-1.15 54.3,52.22 54.3,52.93 56.26,54.89 58.4,54.89 59.28,55.78 C8.2 59.46,55.78 69.77,55.78 73.33,52.22 R6.2 | v79.55,44.58 IC6-4.9 | v104.8,8.84 96.98,8.84 96.8,9.02 95.02,9.02 | 95.02,9.02 94.84,9.02 93.78,10.08 X1.C2 | 95.02,9.02 93.78,7.77 X1.B2 | 106.93,45.47 106.93,54 105.16,55.78 C10.2 106.93,57.73 106.93,71.78 105.16,73.56 JP2.3 | 106.93,45.47 106.93,41.73 105.16,39.95 105.16,39.42 IC1-0.9 | 106.93,45.47 111.02,45.47 111.73,44.76 111.73,44.04 111.2,43.51 109.78,43.51 108.53,42.27 108.53,28.93 110.13,27.33 110.13,26.8 RN1.1 | C7.2 36.52,55.78 43.99,55.78 47.55,52.22 50.39,52.22 R2.2

## Text on the board
tNames: WP | onepagecomputer.com | YACC1 TEST BOARD V1.0 | DATA[0..15] | ADDR[0..15]